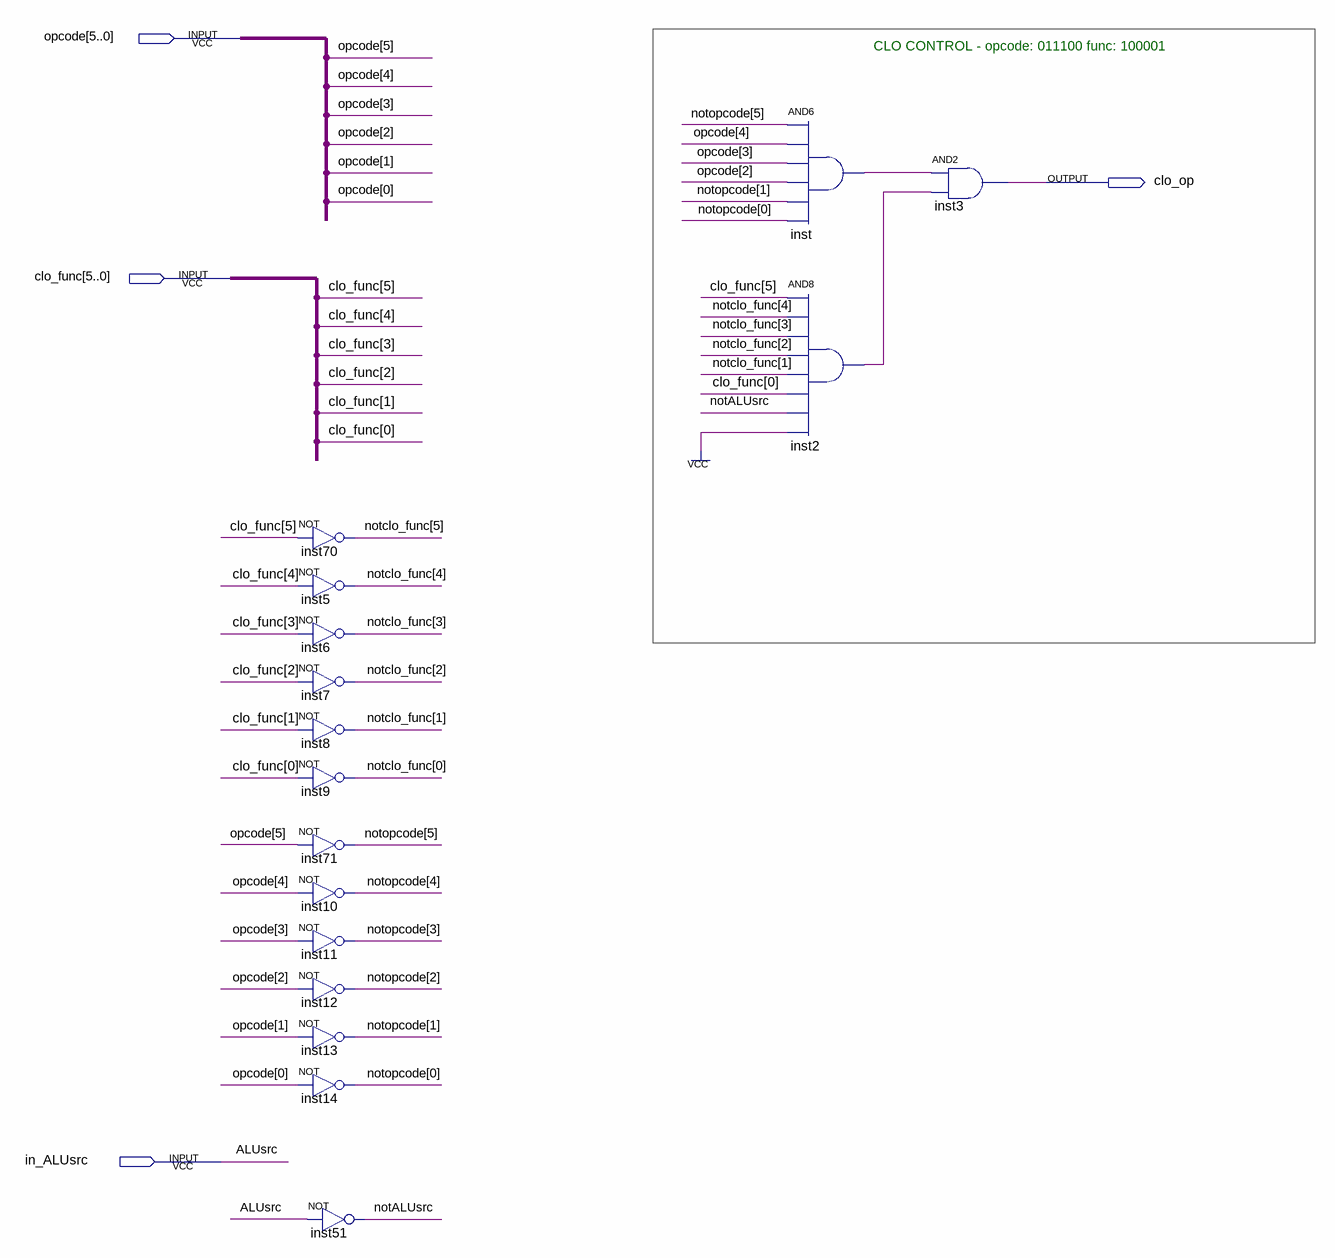
[diagram p0: schematic sheet]
// Quartus schematic clo_id.bdf as structural Verilog: 16 symbols, 4 pins
module clo_id (
  input  [5:0] opcode,
  input  [5:0] clo_func,
  input  in_ALUsrc,
  output clo_op
);

  wire inst2_out, inst_out, notALUsrc;
  wire [5:0] notclo_func, notopcode;

  not inst70 (notclo_func[5], clo_func[5]);
  not inst5 (notclo_func[4], clo_func[4]);
  not inst6 (notclo_func[3], clo_func[3]);
  not inst7 (notclo_func[2], clo_func[2]);
  not inst8 (notclo_func[1], clo_func[1]);
  not inst9 (notclo_func[0], clo_func[0]);
  not inst71 (notopcode[5], opcode[5]);
  not inst10 (notopcode[4], opcode[4]);
  not inst11 (notopcode[3], opcode[3]);
  not inst12 (notopcode[2], opcode[2]);
  not inst13 (notopcode[1], opcode[1]);
  not inst14 (notopcode[0], opcode[0]);
  not inst51 (notALUsrc, in_ALUsrc);
  and inst (inst_out, notopcode[5], opcode[4], opcode[3], opcode[2], notopcode[1], notopcode[0]);
  and inst2 (inst2_out, clo_func[5], notclo_func[4], notclo_func[3], notclo_func[2], notclo_func[1], clo_func[0], notALUsrc, 1'b1);
  and inst3 (clo_op, inst_out, inst2_out);

  // Other names for the same wires on the sheet: ALUsrc = in_ALUsrc

  // Notes on the sheet:
  //   CLO CONTROL - opcode: 011100 func: 100001
endmodule
